# Altium project BU_fNIR_V1I1.PrjPcb
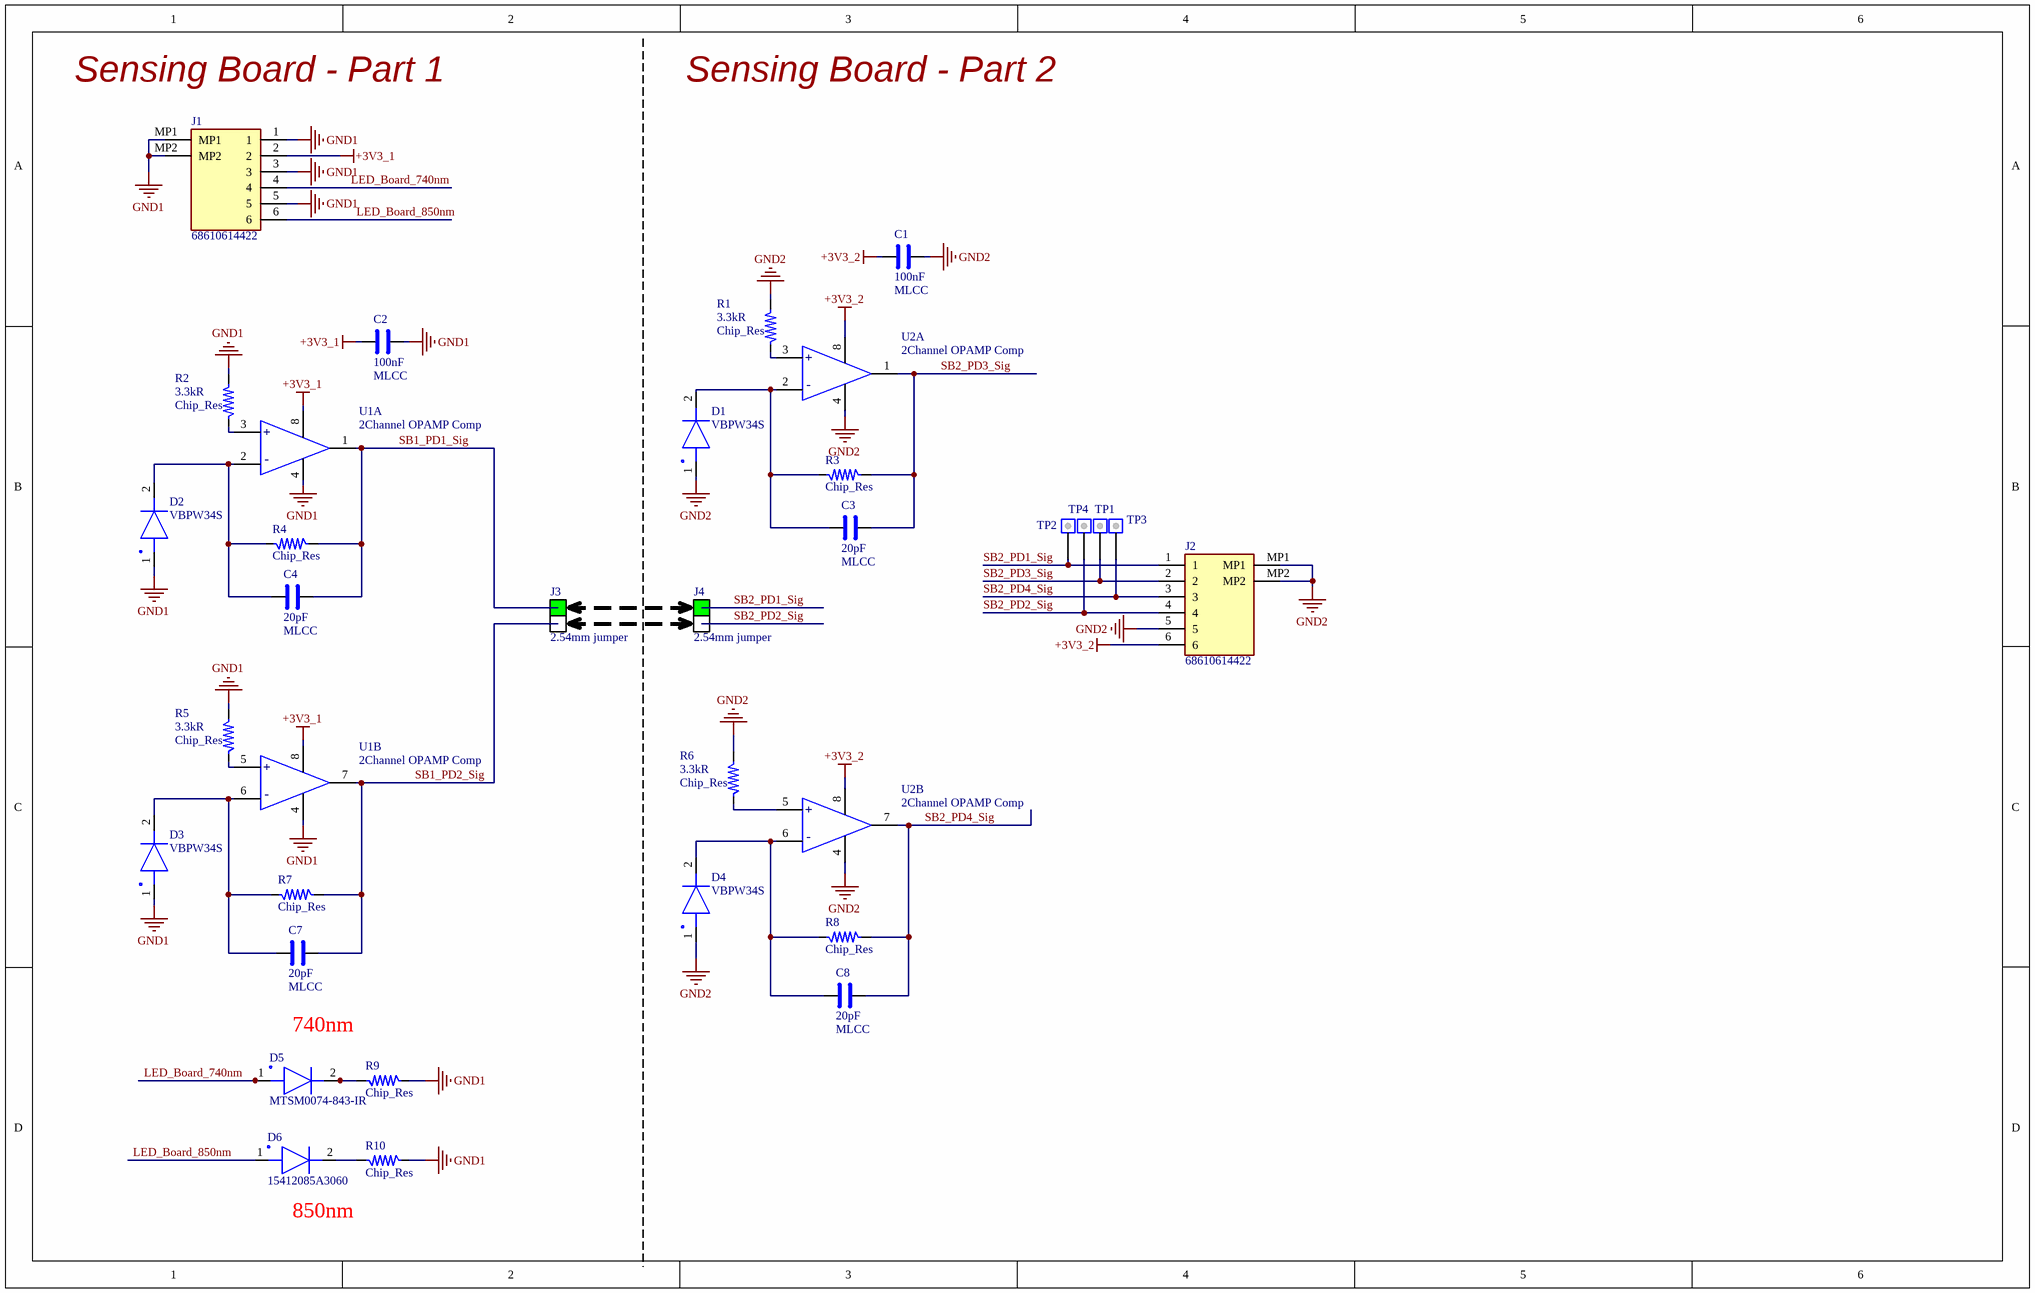
[diagram p0: [3]-LEDBoard.SchDoc]
2 sheets, 82 parts. Net scope: global (net labels, ports and power ports of the same name join across sheets).
Board files: BU_fNIR_V1I1.PcbDoc, Panel.PcbDoc, MCUBoard.PcbDoc, IR1.PcbDoc, IR2.PcbDoc
Sheets:
  [3]-LEDBoard.SchDoc
  [4]-Driver.SchDoc

## Sheet [3]-LEDBoard.SchDoc
size B; SheetNumber: 1; SheetTotal: 2

### Parts
C1  MLCC  value 100nF  [CAPC1005X06L]
C2  MLCC  value 100nF  [CAPC1005X06L]
C3  MLCC  value 20pF  [CAPC1608X09M]
C4  MLCC  value 20pF  [CAPC1608X09M]
C7  MLCC  value 20pF  [CAPC1608X09M]
C8  MLCC  value 20pF  [CAPC1608X09M]
D1  VBPW34S  [VBPW34S]
D2  VBPW34S  [VBPW34S]
D3  VBPW34S  [VBPW34S]
D4  VBPW34S  [VBPW34S]
D5  MTSM0074-843-IR  [MTSM0074-843-IR]
D6  15412085A3060  [15412085A3060]
J1  68610614422  [68610614422]
J2  68610614422  [68610614422]
J3  2.54mm jumper  [FP_Jumper_2x2_54mm]
J4  2.54mm jumper  [FP_Jumper_2x2_54mm]
R1  Chip_Res  value 3.3kR  [RESC1005X04M]
R2  Chip_Res  value 3.3kR  [RESC1005X04M]
R3  Chip_Res  [RESC1608X06M]
R4  Chip_Res  [RESC1608X06M]
R5  Chip_Res  value 3.3kR  [RESC1005X04M]
R6  Chip_Res  value 3.3kR  [RESC1005X04M]
R7  Chip_Res  [RESC1608X06M]
R8  Chip_Res  [RESC1608X06M]
R9  Chip_Res  [RESC1608X06M]
R10  Chip_Res  [RESC1608X06M]
TP1  TP  [FP-TP_SMD_Narrow]  (value not drawn)
TP2  TP  [FP-TP_SMD_Narrow]  (value not drawn)
TP3  TP  [FP-TP_SMD_Narrow]  (value not drawn)
TP4  TP  [FP-TP_SMD_Narrow]  (value not drawn)
U1  2Channel OPAMP Comp  [TSOP65P490X110-8L]  (parts A,B of 2)
U2  2Channel OPAMP Comp  [TSOP65P490X110-8L]  (parts A,B of 2)

### Nets
+3V3_1: C2.1 J1.2 U1.8(VCC)
+3V3_2: C1.1 J2.6 U2.8(VCC)
GND1: C2.2 D2.1(Anode) D3.1(Anode) J1.1 J1.3 J1.5 J1.MP1 J1.MP2 R2.1 R5.1 R9.2 R10.2 U1.4(GND)
GND2: C1.2 D1.1(Anode) D4.1(Anode) J2.5 J2.MP1 J2.MP2 R1.1 R6.1 U2.4(GND)
LED_Board_740nm: D5.1(Anode) J1.4
LED_Board_850nm: D6.1(Anode) J1.6
SB1_PD1_Sig: C4.2 J3.1 R4.1 U1.1(1OUT)
SB1_PD2_Sig: C7.2 J3.2 R7.1 U1.7(2OUT)
SB2_PD1_Sig: J2.1 J4.1 TP2.NODE
SB2_PD2_Sig: J2.4 J4.2 TP4.NODE
SB2_PD3_Sig: C3.2 J2.2 R3.1 TP1.NODE U2.1(1OUT)
SB2_PD4_Sig: C8.2 J2.3 R8.1 TP3.NODE U2.7(2OUT)
NetC3_1: C3.1 D1.2(Cathode) R3.2 U2.2(1IN-)
NetC4_1: C4.1 D2.2(Cathode) R4.2 U1.2(1IN-)
NetC7_1: C7.1 D3.2(Cathode) R7.2 U1.6(2IN-)
NetC8_1: C8.1 D4.2(Cathode) R8.2 U2.6(2IN-)
NetD5_2: D5.2(Cathode) R9.1
NetD6_2: D6.2(Cathode) R10.1
NetR1_2: R1.2 U2.3(1IN+)
NetR2_2: R2.2 U1.3(1IN+)
NetR5_2: R5.2 U1.5(2IN+)
NetR6_2: R6.2 U2.5(2IN+)

### Notes on the sheet
- (near J1) Sensing Board - Part 1
- Sensing Board - Part 2
- 740nm
- 850nm
- (in symbol OPA2380AIDGKR, part A) +
- (in symbol OPA2380AIDGKR, part B) +

### Library data of the parts
C1 C2 = CC0402KRX7R8BB104: Multilayer Ceramic Capacitor, 0.1 uF, 25 V, ± 10%, X7R, 0402 [1005 Metric]; Manufacturer: Yageo; ID: 1; Voltage Rating: 25V; Part Number: CC0402KRX7R8BB104; Table: MLCC 0402; Supplier: Digikey; Supplier Part Number: 311-2077-6-ND; Manufacturer Part Number: CC0402KRX7R8BB104; Tolerance: 10%; Dielectric: X7R; Category: Ceramic Capacitors; Case/Package: 0402; Case Code (Metric): 1005; Case Code (Imperial): 0402; Series: CC
C3 C4 C7 C8 = CC0603JRNPO9BN200: Multilayer Ceramic Capacitor, 20 pF, 50 V, ± 5%, C0G (NP0), 0603 [1608 Metric]; Manufacturer: Yageo; ID: 17; Voltage Rating: 50V; Dielectric: C0G, NP0; Part Number: CC0603JRNPO9BN200; Table: MLCC 0603; Supplier: Digikey; Supplier Part Number: 311-1424-6-ND; Manufacturer Part Number: CC0603JRNPO9BN200; Tolerance: 5%; Category: Ceramic Capacitors; Case/Package: 0603; Case Code (Metric): 1608; Case Code (Imperial): 0603; Series: CC
D1-D4 = VBPW34S: Photodiode 940nm 100ns 130° 2-SMD, Gull Wing; Manufacturer: Vishay; ID: 1; Table: Light Pipe; Part Number: VBPW34S; Manufacturer Part Number: VBPW34S; Supplier Part Number: 751-1500-2-ND; Supplier: Digikey; Category: Photodiodes; RoHS: Yes
D5 = MTSM0074-843-IR: Infrared (IR) Emitter 740nm 1.7V 30mA 3.2mW/sr @ 30mA 1206 (3216 Metric); Manufacturer: Marktech Optoelectronics; ID: 0; Table: LED Inferared; Part Number: MTSM0074-843-IR; Manufacturer Part Number: MTSM0074-843-IR; Supplier Part Number: 1125-MTSM0074-843-IRTR-ND; Supplier: Digikey; Category: LED Emitters - Infrared, UV, Visible; RoHS: Yes
D6 = 15412085A3060: Infrared (IR) Emitter 850nm 1.4V 15mW/sr @ 20mA 30° 1206 (3216 Metric); Manufacturer: Wurth Elektronik; ID: 1; Table: LED Inferared; Part Number: 15412085A3060; Manufacturer Part Number: 15412085A3060; Supplier Part Number: 732-12009-2-ND; Supplier: Digikey; Category: LED Emitters - Infrared, UV, Visible; RoHS: Yes
J1 J2 = 68610614422: 6 Position FPC Connector Contacts, Bottom 0.039" (1.00mm) Surface Mount, Right Angle; Manufacturer: Würth Elektronik; ID: 1; Table: FCC/FPC; Pitch: 1mm; Part Number: 68610614422; Manufacturer Part Number: 68610614422; Supplier Part Number: 732-1994-2-ND; Supplier: Digikey; RoHS: Yes; Category: FFC, FPC (Flat Flexible) Connector Assemblies; Pins: 6; Contact Material: Phosphor Bronze; Contact Plating: Tin; Orientation: Right Angle
J3 J4 = Header2x1: 2x2.54mm conventional header as jumper; ID: 19; Table: Header Connector; Header Orientation: Straight; Pitch: 0.100" (2.54mm); Number of Positions: 2; Number of Levels: 1; Part Number: Header2x1; Connector Type: Header; Category: Connectors; Positions Per Level: 2; Number of Rows: 2
R1 R2 R5 R6 = RC0402JR-073K3L: SMD Chip Resistor, 3.3 kOhm, ± 5%, 63 mW, 0402 [1005 Metric], Thick Film, General Purpose; Manufacturer: Yageo; ID: 20; Power Rating: 62.5mW; Temperature Coefficient: 100ppm/°C; Part Number: RC0402JR-073K3L; Table: Resistor 0402; Manufacturer Part Number: RC0402JR-073K3L; Supplier Part Number: 311-3.3KJRDKR-ND; Supplier: Digikey; Termination: SMD/SMT; Tolerance: 5%; Resistor Type: Thick Film; Series: RC; Features: Moisture Resistant; Category: Chip SMD Resistors; Min Operating Temperature: -55°C; Max Operating Temperature: 155°C; RoHS: Yes; Case/Package: 0402; Case Code (Imperial): 0402; Case Code (Metric): 1005
R3 R4 R7 R8 = RC0603FR-07887RL: Res Thick Film 0603 887 Ohm 1% 1/10W ±100ppm/°C Molded SMD SMD Paper T/R; Manufacturer: Yageo; ID: 3; Value: 887R; Power Rating: 100mW; Part Number: RC0603FR-07887RL; Table: Resistor 0603; Manufacturer Part Number: RC0603FR-07887RL; Supplier Part Number: 311-887HRDKR-ND; Supplier: Digikey; Tolerance: 1%; Resistor Type: Thick Film; Features: Moisture Resistant; Series: RC_L; Temperature Coefficient: 100ppm/°C; RoHS: Yes; Category: Chip SMD Resistors; Case/Package: 0603; Case Code (Imperial): 0603; Case Code (Metric): 1608
R9 R10 = AC0603FR-1333KL: SMD Chip Resistor, 33 kOhm, ± 1%, 100 mW, 0603 [1608 Metric], Thick Film, General Purpose; Manufacturer: Yageo; ID: 9; Value: 33kR; Power Rating: 100mW; Temperature Coefficient: 100ppm/°C; Part Number: AC0603FR-1333KL; Table: Resistor 0603; Manufacturer Part Number: AC0603FR-1333KL; Supplier Part Number: 603-AC0603FR-1333KL; Supplier: Mouser; Tolerance: 1%; Resistor Type: Thick Film; Series: AC; RoHS: Yes; Category: Chip SMD Resistors; Case/Package: 0603; Case Code (Imperial): 0603; Case Code (Metric): 1608
TP1-TP4 = Test Point: A simple test point; ID: 3; Table: Misc; Part Number: Test Point
U1 U2 = OPA2380AIDGKR: Manufacturer: Texas Instruments; ID: 0; Table: IC OP-AMP; Slew Rate: 80 V/us; Gain Bandwidth Product: 90MHz; Part Number: OPA2380AIDGKR; Manufacturer Part Number: OPA2380AIDGKR; Supplier Part Number: 296-48627-2-ND; Supplier: Digikey; Category: Instrumentation, Op Amps, Buffer Amps; RoHS: Yes; Series: -; Case/Package: VSSOP; Mounting Technology: SMD/SMT; Min Operating Temperature: - 40 C; Max Operating Temperature: 125°C

## Sheet [4]-Driver.SchDoc
size B; SheetNumber: 2; SheetTotal: 2
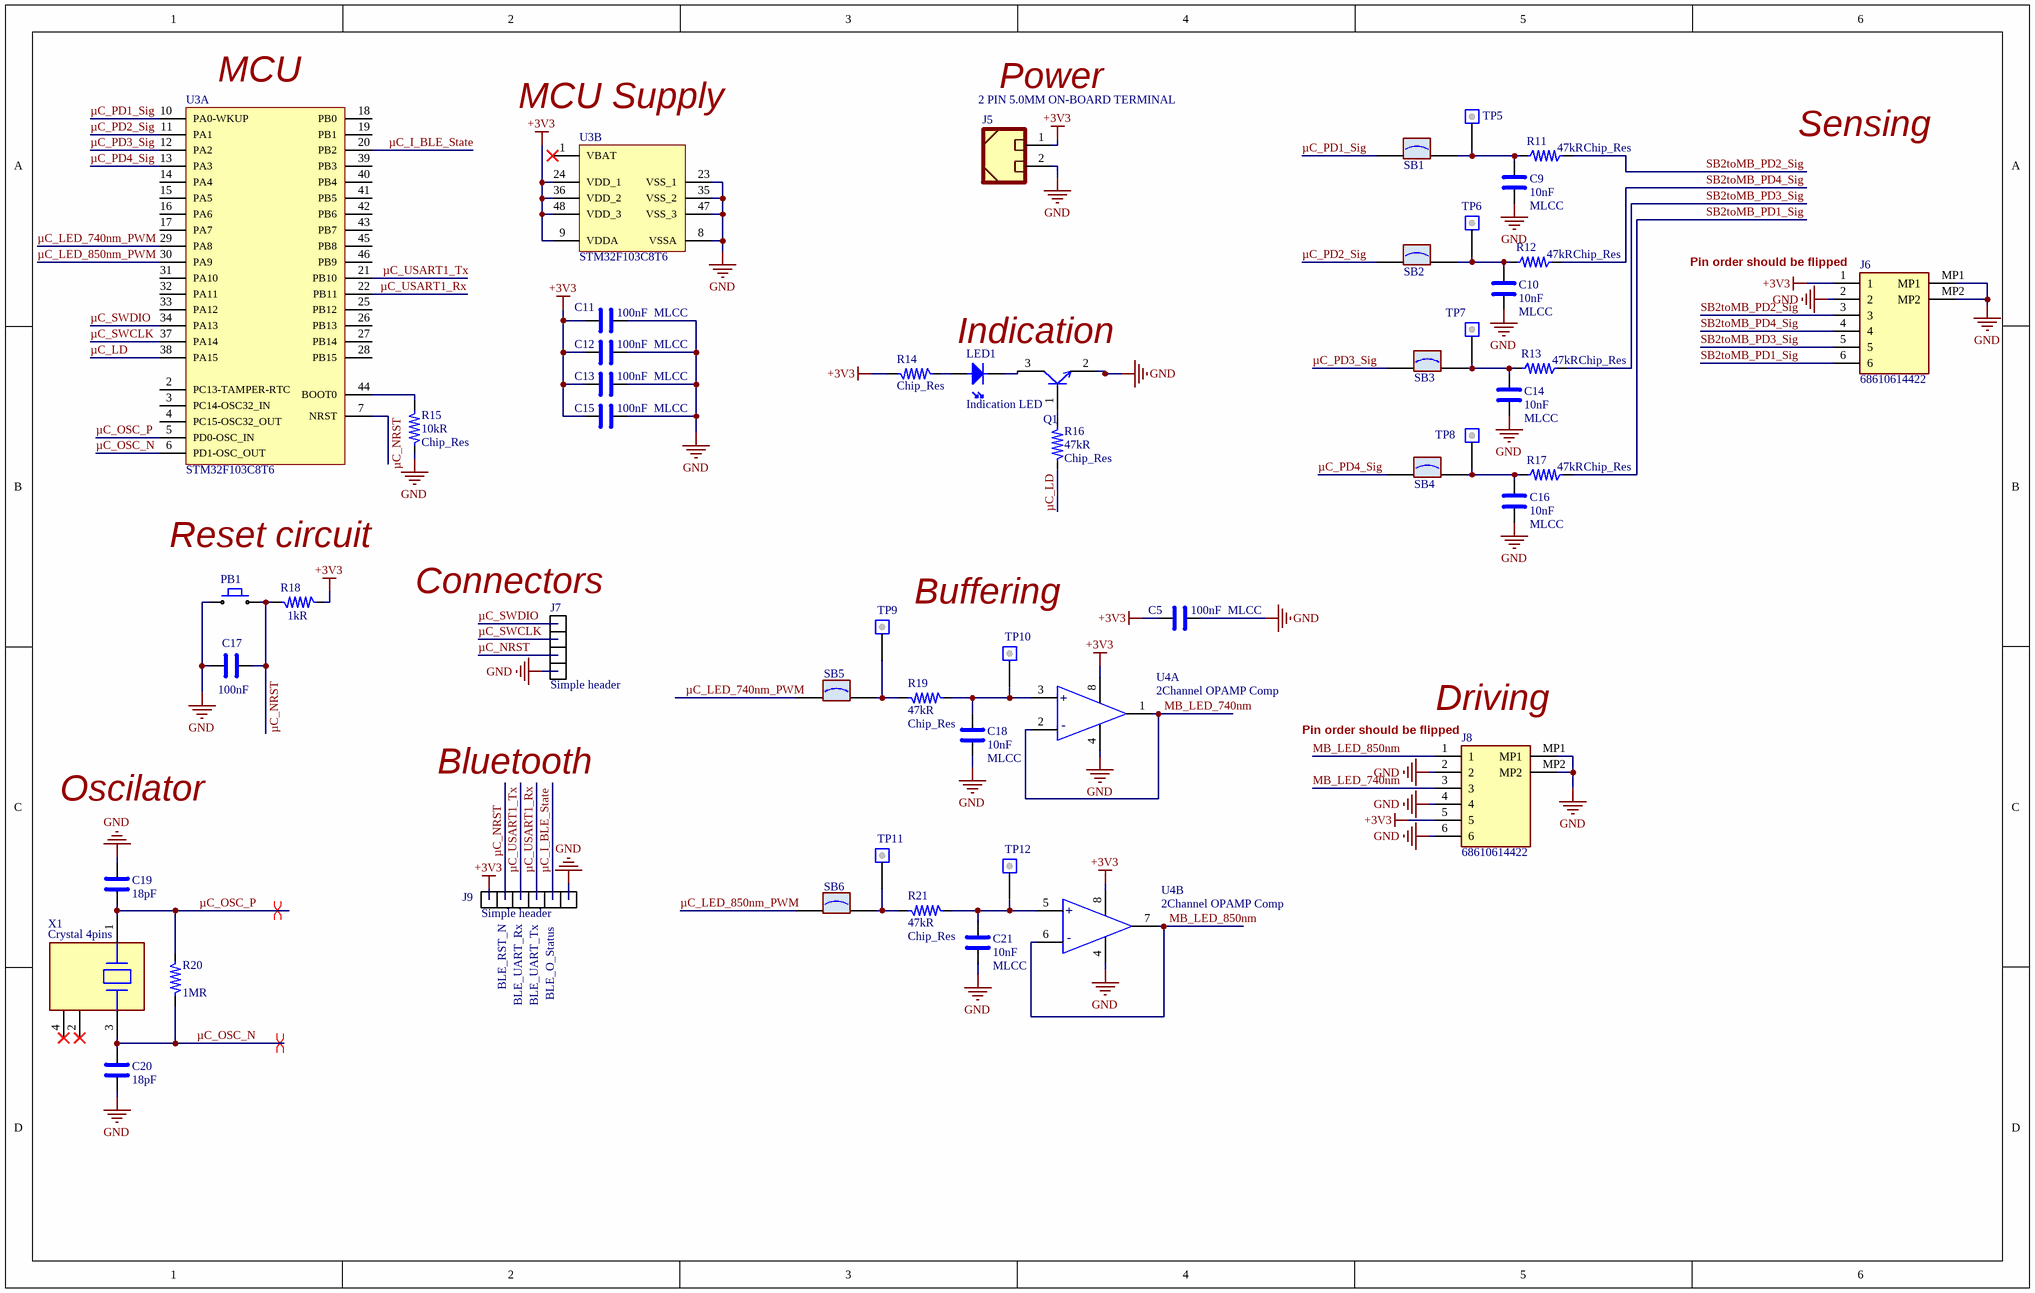
[diagram p1: [4]-Driver.SchDoc]

### Parts
C5  MLCC  value 100nF  [CAPC1608X09M]
C9  MLCC  value 10nF  [CAPC1005X06M]
C10  MLCC  value 10nF  [CAPC1005X06M]
C11  MLCC  value 100nF  [CAPC1608X09M]
C12  MLCC  value 100nF  [CAPC1608X09M]
C13  MLCC  value 100nF  [CAPC1608X09M]
C14  MLCC  value 10nF  [CAPC1005X06M]
C15  MLCC  value 100nF  [CAPC1608X09M]
C16  MLCC  value 10nF  [CAPC1005X06M]
C17  value 100nF  [CAPC1005X06L]  (hidden comment: MLCC)
C18  MLCC  value 10nF  [CAPC1005X06M]
C19  value 18pF  [CAPC1005X06L]  (hidden comment: MLCC)
C20  value 18pF  [CAPC1005X06L]  (hidden comment: MLCC)
C21  MLCC  value 10nF  [CAPC1005X06M]
J5  2 PIN 5.0MM ON-BOARD TERMINAL  [KF127-5.0-2P]
J6  68610614422  [68610614422]
J7  Simple header  [FP-Header_4x2_54mm]
J8  68610614422  [68610614422]
J9  Simple header  [DS1021-1X6S25]
LED1  Indication LED  [LEDC2012X110N]
PB1  SWITCH TACTILE SPST-NO 0.05A 12V  [FP-PB_SMD]  (value not drawn)
Q1  NPN 45V 0.5A  [SOT65P210X110-3M]  (value not drawn)
R11  Chip_Res  value 47kR  [RESC1005X04M]
R12  Chip_Res  value 47kR  [RESC1005X04M]
R13  Chip_Res  value 47kR  [RESC1005X04M]
R14  Chip_Res  [RESC1608X06M]
R15  Chip_Res  value 10kR  [RESC1005X04M]
R16  Chip_Res  value 47kR  [RESC1005X04M]
R17  Chip_Res  value 47kR  [RESC1005X04M]
R18  value 1kR  [RESC1005X04L]  (hidden comment: Chip_Res)
R19  Chip_Res  value 47kR  [RESC1005X04M]
R20  value 1MR  [RESC1005X04L]  (hidden comment: Chip_Res)
R21  Chip_Res  value 47kR  [RESC1005X04M]
SB1  SB  [FP-SB_0_8mm]  (value not drawn)
SB2  SB  [FP-SB_0_8mm]  (value not drawn)
SB3  SB  [FP-SB_0_8mm]  (value not drawn)
SB4  SB  [FP-SB_0_8mm]  (value not drawn)
SB5  SB  [FP-SB_0_8mm]  (value not drawn)
SB6  SB  [FP-SB_0_8mm]  (value not drawn)
TP5  TP  [FP-TP_DIP]  (value not drawn)
TP6  TP  [FP-TP_DIP]  (value not drawn)
TP7  TP  [FP-TP_DIP]  (value not drawn)
TP8  TP  [FP-TP_DIP]  (value not drawn)
TP9  TP  [FP-TP_DIP]  (value not drawn)
TP10  TP  [FP-TP_SMD_Narrow]  (value not drawn)
TP11  TP  [FP-TP_DIP]  (value not drawn)
TP12  TP  [FP-TP_SMD_Narrow]  (value not drawn)
U3  STM32F103C8T6  [STM-LQFP48_N]  (parts A,B of 2)
U4  2Channel OPAMP Comp  [SOIC127P600X175-8N]  (parts A,B of 2)
X1  Crystal 4pins  [FP-ABM8-MFG]

### Nets
+3V3: C5.1 C11.1 C12.1 C13.1 C15.1 J5.1 J6.1 J8.5 J9.1 R14.1 R18.2 U3.9(VDDA) U3.24(VDD_1) U3.36(VDD_2) U3.48(VDD_3) U4.8(VCC)
GND: C5.2 C9.1 C10.1 C11.2 C12.2 C13.2 C14.1 C15.2 C16.1 C17.1 C18.1 C19.2 C20.1 C21.1 J5.2 J6.2 J6.MP1 J6.MP2 J7.4 J8.2 J8.4 J8.6 J8.MP1 J8.MP2 J9.6 PB1.1 Q1.2(Emitter) R15.2 U3.8(VSSA) U3.23(VSS_1) U3.35(VSS_2) U3.47(VSS_3) U4.4(GND)
MB_LED_740nm: J8.3 U4.1(1OUT) U4.2(1IN-)
MB_LED_850nm: J8.1 U4.6(2IN-) U4.7(2OUT)
SB2toMB_PD1_Sig: J6.6 R17.1
SB2toMB_PD2_Sig: J6.3 R11.1
SB2toMB_PD3_Sig: J6.5 R13.1
SB2toMB_PD4_Sig: J6.4 R12.1
µC_I_BLE_State: J9.5 U3.20(PB2)
µC_LD: R16.2 U3.38(PA15)
µC_LED_740nm_PWM: SB5.1 U3.29(PA8)
µC_LED_850nm_PWM: SB6.1 U3.30(PA9)
µC_NRST: C17.2 J7.3 J9.2 PB1.2 R18.1 U3.7(NRST)
µC_OSC_N: C20.2 R20.1 U3.6(PD1-OSC_OUT) X1.3
µC_OSC_P: C19.1 R20.2 U3.5(PD0-OSC_IN) X1.1
µC_PD1_Sig: SB1.2 U3.10(PA0-WKUP)
µC_PD2_Sig: SB2.2 U3.11(PA1)
µC_PD3_Sig: SB3.2 U3.12(PA2)
µC_PD4_Sig: SB4.2 U3.13(PA3)
µC_SWCLK: J7.2 U3.37(PA14)
µC_SWDIO: J7.1 U3.34(PA13)
µC_USART1_Rx: J9.4 U3.22(PB11)
µC_USART1_Tx: J9.3 U3.21(PB10)
NetC9_2: C9.2 R11.2 SB1.1 TP5.NODE
NetC10_2: C10.2 R12.2 SB2.1 TP6.NODE
NetC14_2: C14.2 R13.2 SB3.1 TP7.NODE
NetC16_2: C16.2 R17.2 SB4.1 TP8.NODE
NetC18_2: C18.2 R19.2 TP10.NODE U4.3(1IN+)
NetC21_2: C21.2 R21.2 TP12.NODE U4.5(2IN+)
NetLED1_1: LED1.1 R14.2
NetLED1_2: LED1.2 Q1.3(Collector)
NetQ1_1: Q1.1(Base) R16.1
NetR15_1: R15.1 U3.44(BOOT0)
NetR19_1: R19.1 SB5.2 TP9.NODE
NetR21_1: R21.1 SB6.2 TP11.NODE

Not connected (* = marked no-connect by the designer): U3 1(VBAT)* 2(PC13-TAMPER-RTC) 3(PC14-OSC32_IN) 4(PC15-OSC32_OUT) 14(PA4) 15(PA5) 16(PA6) 17(PA7) 18(PB0) 19(PB1) 25(PB12) 26(PB13) 27(PB14) 28(PB15) 31(PA10) 32(PA11) 33(PA12) 39(PB3) 40(PB4) 41(PB5) 42(PB6) 43(PB7) 45(PB8) 46(PB9); X1 2* 4*

### Layout directives
differential pair: µC_OSC_N, µC_OSC_P

### Notes on the sheet
- (near U3) MCU
- (near U3) MCU Supply
- (near J5) Power
- Sensing
- (near J6) Pin order should be flipped
- Indication
- Reset circuit
- (near J7) Connectors
- Buffering
- (near J8) Driving
- Bluetooth
- (near J8) Pin order should be flipped
- Oscilator
- (near J9) BLE_RST_N
- (near J9) BLE_UART_Rx
- (near J9) BLE_UART_Tx
- (near J9) BLE_O_Status
- (in symbol OPA2377AIDR, part A) +
- (in symbol OPA2377AIDR, part B) +

### Library data of the parts
C5 C11-C13 C15 = GCM188R71H104KA57D: Multilayer Ceramic Capacitor, 0.1 uF, 50 V, ± 10%, X7R, 0603 [1608 Metric]; Manufacturer: Murata; ID: 13; Voltage Rating: 50V; Part Number: GCM188R71H104KA57D; Table: MLCC 0603; Supplier: Digikey; Supplier Part Number: 490-4779-6-ND; Manufacturer Part Number: GCM188R71H104KA57D; Tolerance: 10%; Dielectric: X7R; Category: Ceramic Capacitors; Case/Package: 0603; Case Code (Metric): 1608; Case Code (Imperial): 0603; Series: GCM
C9 C10 C14 C16 C18 C21 = GRM155R71E103KA01D: Multilayer Ceramic Capacitor, 0.01 uF, 25 V, ± 10%, X7R, 0402 [1005 Metric]; Manufacturer: Murata; ID: 12; Voltage Rating: 25V; Part Number: GRM155R71E103KA01D; Table: MLCC 0402; Supplier: Digikey; Supplier Part Number: 490-1312-6-ND; Manufacturer Part Number: GRM155R71E103KA01D; Tolerance: 10%; Dielectric: X7R; Category: Ceramic Capacitors; Case/Package: 0402; Case Code (Metric): 1005; Case Code (Imperial): 0402; Series: GRM
C17 = GRM155R71C104KA88J: Multilayer Ceramic Capacitor, 0.1 uF, 16 V, ± 10%, X7R, 0402 [1005 Metric]; Manufacturer: Murata; ID: 10; Voltage Rating: 16V; Part Number: GRM155R71C104KA88J; Supplier: Digikey; Supplier Part Number: 490-6328-6-ND; Manufacturer Part Number: GRM155R71C104KA88J; Tolerance: 10%; Dielectric: X7R; Category: Ceramic Capacitors; Case/Package: 0402; Case Code (Metric): 1005; Case Code (Imperial): 0402; Series: GRM; Table: MLCC 0402
C19 C20 = GRM1555C1H180JA01D: Multilayer Ceramic Capacitor, 18 pF, 50 V, ± 5%, C0G (NP0), 0402 [1005 Metric]; Manufacturer: Murata; ID: 7; Voltage Rating: 50V; Dielectric: C0G, NP0; Part Number: GRM1555C1H180JA01D; Supplier: Digikey; Supplier Part Number: 490-5858-6-ND; Manufacturer Part Number: GRM1555C1H180JA01D; Tolerance: 5%; Category: Ceramic Capacitors; Case/Package: 0402; Case Code (Metric): 1005; Case Code (Imperial): 0402; Series: GRM; Table: MLCC 0402
J5 = KF127-5.0-2P: Manufacturer: Cixi Kefa Electronics; ID: 2; Table: Header Connector; Connector Type: Terminal Socket; Header Orientation: Straight; Pitch: 5mm; Number of Levels: 1; Part Number: KF127-5.0-2P; Manufacturer Part Number: KF127-5.0-2P; Supplier Part Number: KF127-5.0-2P; Supplier: JavanElec; Category: Connectors; Number of Positions: 2; Positions Per Level: 2; Number of Rows: 1
J6 J8 = 68610614422: as J1 on sheet [3]-LEDBoard; Part Number: 68610614422; Manufacturer Part Number: 68610614422; Supplier Part Number: 732-1994-2-ND; Supplier: Digikey; RoHS: Yes; Category: FFC, FPC (Flat Flexible) Connector Assemblies; Pins: 6; Contact Material: Phosphor Bronze; Contact Plating: Tin; Orientation: Right Angle
J7 = Header4x1: 4x2.54mm conventional header as jumper; ID: 21; Table: Header Connector; Header Orientation: Straight; Pitch: 0.100" (2.54mm); Number of Positions: 4; Number of Levels: 1; Part Number: Header4x1; Connector Type: Header; Category: Connectors; RoHS: Yes; Positions Per Level: 4; Number of Rows: 4
J9 = Header6x1: 6x2.54mm conventional header as jumper; ID: 20; Table: Header Connector; Header Orientation: Straight; Pitch: 0.100" (2.54mm); Number of Positions: 6; Number of Levels: 1; Part Number: Header6x1; Connector Type: Header; Category: Connectors; RoHS: Yes; Positions Per Level: 6; Number of Rows: 6
LED1 = LTST-C170KGKT: LED Uni-Color Green 574nm 2-Pin Chip LED T/R; Manufacturer: Vishay Lite-On; ID: 5; Table: Diode LED; Dominant Wavelength: 571nm; Power Rating: 75mW; Forward Voltage: 2V; Forward Current: 20mA; Reverse Voltage: 5V; Lens Color: Colorless; Luminous Intensity: 35mcd; Viewing Angle: 130°; Lens Transparency: Clear; Number of Elements: 1; Lens Size: 1.4mm; Part Number: LTST-C170KGKT; Manufacturer Part Number: LTST-C170KGKT; Supplier Part Number: 160-1414-1-ND; Supplier: Digikey; Category: LEDs; Color: Green; Wavelength: 574nm; RoHS: Yes; Case/Package: 0805; Case Code (Metric): 2012; Case Code (Imperial): 0805; Length: 2mm; Width: 1.25mm; Height: 1.1m; Illumination Color: Green; Number of LEDs: 1; Depth: 1.25mm; Radiation Hardening: No; Lead Free: Lead Free
PB1 = TS09-63-25-R-260-SMT-TR: Tactile Switch SPST-NO Top Actuated Surface Mount; Manufacturer Part Number: CUI Devices; ID: 1; Part Number: TS09-63-25-R-260-SMT-TR; Supplier Part Number: 2223-TS09-63-25-R-260-SMT-TRDKR-ND; Manufacturer: TS09-63-25-R-260-SMT-TR; Number of Positions: 1; Category: Switches / Tactile Switches; Operating Temperature: -30°C ~ 80°C; Length: 6.10mm; Termination Style: Gull Wing; Table: Tactile Switch
Q1 = BC817-40W,115: Bipolar (BJT) Transistor NPN 45 V 500 mA 100MHz 200 mW Surface Mount SOT-323; Manufacturer: Nexperia; ID: 1; Table: Transistor BJT; Current - Collector (Ic) (Max): 500 mA; Power - Max: 200 mW; Part Number: BC817-40W,115; Voltage - Collector Emitter Breakdown (Max): 45 V; Frequency - Transition: 100MHz
R11-R13 R16 R17 R19 R21 = RC0402JR-0747KL: SMD Chip Resistor, 47 kOhm, ± 5%, 63 mW, 0402 [1005 Metric], Thick Film, General Purpose; Manufacturer: Yageo; ID: 46; Power Rating: 63mW; Temperature Coefficient: 100ppm/°C; Part Number: RC0402JR-0747KL; Table: Resistor 0402; Manufacturer Part Number: RC0402JR-0747KL; Supplier Part Number: 311-47KJRDKR-ND; Supplier: Digikey; Termination: SMD/SMT; Tolerance: 5%; Resistor Type: Thick Film; Series: RC_L; Features: Moisture Resistant; Category: Chip SMD Resistors; Min Operating Temperature: -55°C; Max Operating Temperature: 155°C; RoHS: Yes; Case/Package: 0402; Case Code (Imperial): 0402; Case Code (Metric): 1005
R14 = RC0603FR-07470RL: SMD Chip Resistor, 470 Ohm, ± 1%, 100 mW, 0603 [1608 Metric], Thick Film, General Purpose; Manufacturer: Yageo; ID: 15; Value: 470R; Power Rating: 100mW; Temperature Coefficient: 100ppm/°C; Part Number: RC0603FR-07470RL; Table: Resistor 0603; Manufacturer Part Number: RC0603FR-07470RL; Supplier Part Number: 603-RC0603FR-07470RL; Supplier: Mouser; Tolerance: 1%; Resistor Type: Thick Film; Series: RC; RoHS: Yes; Category: Chip SMD Resistors; Case/Package: 0603; Case Code (Imperial): 0603; Case Code (Metric): 1608
R15 = RC0402JR-0710KL: SMD Chip Resistor, 10 kOhm, ± 5%, 63 mW, 0402 [1005 Metric], Thick Film, General Purpose; Manufacturer: Yageo; ID: 43; Power Rating: 62.5mW; Temperature Coefficient: 100ppm/°C; Part Number: RC0402JR-0710KL; Table: Resistor 0402; Manufacturer Part Number: RC0402JR-0710KL; Supplier Part Number: 311-10KJRDKR-ND; Supplier: Digikey; Termination: SMD/SMT; Tolerance: 5%; Resistor Type: Thick Film; Series: RC; Features: Moisture Resistant; Category: Chip SMD Resistors; Min Operating Temperature: -55°C; Max Operating Temperature: 155°C; RoHS: Yes; Case/Package: 0402; Case Code (Imperial): 0402; Case Code (Metric): 1005
R18 = RC0402JR-071KL: SMD Chip Resistor, 1 kOhm, ± 5%, 63 mW, 0402 [1005 Metric], Thick Film, General Purpose; Manufacturer: Yageo; ID: 28; Power Rating: 62.5mW; Temperature Coefficient: 100ppm/°C; Part Number: RC0402JR-071KL; Manufacturer Part Number: RC0402JR-071KL; Supplier Part Number: 311-1.0KJRDKR-ND; Supplier: Digikey; Termination: SMD/SMT; Tolerance: 5%; Resistor Type: Thick Film; Series: RC; Features: Moisture Resistant; Category: Chip SMD Resistors; Min Operating Temperature: -55°C; Max Operating Temperature: 155°C; RoHS: Yes; Case/Package: 0402; Case Code (Imperial): 0402; Case Code (Metric): 1005; Table: Resistor 0402
R20 = RC0402JR-071ML: SMD Chip Resistor, 1 MOhm, ± 5%, 63 mW, 0402 [1005 Metric], Thick Film, General Purpose; Manufacturer: Yageo; ID: 23; Power Rating: 62.5mW; Temperature Coefficient: 100ppm/°C; Part Number: RC0402JR-071ML; Manufacturer Part Number: RC0402JR-071ML; Supplier Part Number: 311-1.0MJRDKR-ND; Supplier: Digikey; Termination: SMD/SMT; Tolerance: 5%; Resistor Type: Thick Film; Series: RC; Features: Moisture Resistant; Category: Chip SMD Resistors; Min Operating Temperature: -55°C; Max Operating Temperature: 155°C; RoHS: Yes; Case/Package: 0402; Case Code (Imperial): 0402; Case Code (Metric): 1005; Table: Resistor 0402
SB1-SB6 = Solder Bridge: A simple solder bridge; ID: 2; Table: Misc; Part Number: Solder Bridge
TP5-TP12 = Test Point: A simple test point; ID: 3; Table: Misc; Part Number: Test Point
U3 = STM32F103C8T6TR: MCU 32-bit STM32F1 ARM Cortex M3 RISC 64KB Flash 2.5V/3.3V 48-Pin LQFP T/R; Manufacturer: STMicroelectronics; ID: 1; Table: IC Micro-Controller; Data Bus Width: 32b; Clock Frequency: 72MHz; Part Number: STM32F103C8T6TR; Manufacturer Part Number: STM32F103C8T6TR; Supplier Part Number: 511-STM32F103C8T6TR; Supplier: Mouser; RoHS: Yes; Category: Microcontrollers; Series: STM32F103C8; Core Architecture: ARM; Case/Package: LQFP; Width: 7mm; Height: 1.4mm; Weight: 0.006409oz
U4 = OPA2377AIDR: CMOS Amplifier 2 Circuit Rail-to-Rail 8-SOIC; Manufacturer: Texas Instruments; ID: 3; Table: IC OP-AMP; Number of Channels: 2; Slew Rate: 2 V/us; Gain Bandwidth Product: 5.5 MHz; Output Current per Channel: 50 mA; Part Number: OPA2377AIDR; Manufacturer Part Number: OPA2377AIDR; Supplier Part Number: 296-41358-2-ND; Supplier: Digikey; Category: Instrumentation, Op Amps, Buffer Amps; RoHS: Yes; Series: -; Case/Package: 8-SOIC; Mounting Technology: SMD/SMT; Min Operating Temperature: - 40 C; Max Operating Temperature: 125°C
X1 = ABM8AIG-8.000MHZ-1Z-T: 8 MHz ±10ppm Crystal 18pF 500 Ohms 4-SMD, No Lead; ID: 8; Table: Crystal-Oscillator; Part Number: ABM8AIG-8.000MHZ-1Z-T; Manufacturer Part Number: ABM8AIG-8.000MHZ-1Z-T; Supplier Part Number: 535-15256-2-ND; Supplier: Digikey; RoHS: Yes; Category: Crystals